# EasyEDA Pro project Raspberry_LCD_2023-10-31_10-21-50.eprj

# Schematic Schematic1
Create Date: 2023-10-31; Page Name: P1; Project Name: Raspberry_LCD_2023-10-31_10-21-50; Schematic Name: Schematic1; Update Date: 2023-10-31; Company: EasyEDA.com; Drawed: EasyEDA Pro; Page Size: A4; Part Number: JLCPCB-002; Reviewed: EasyEDA Pro; Version: V0.1
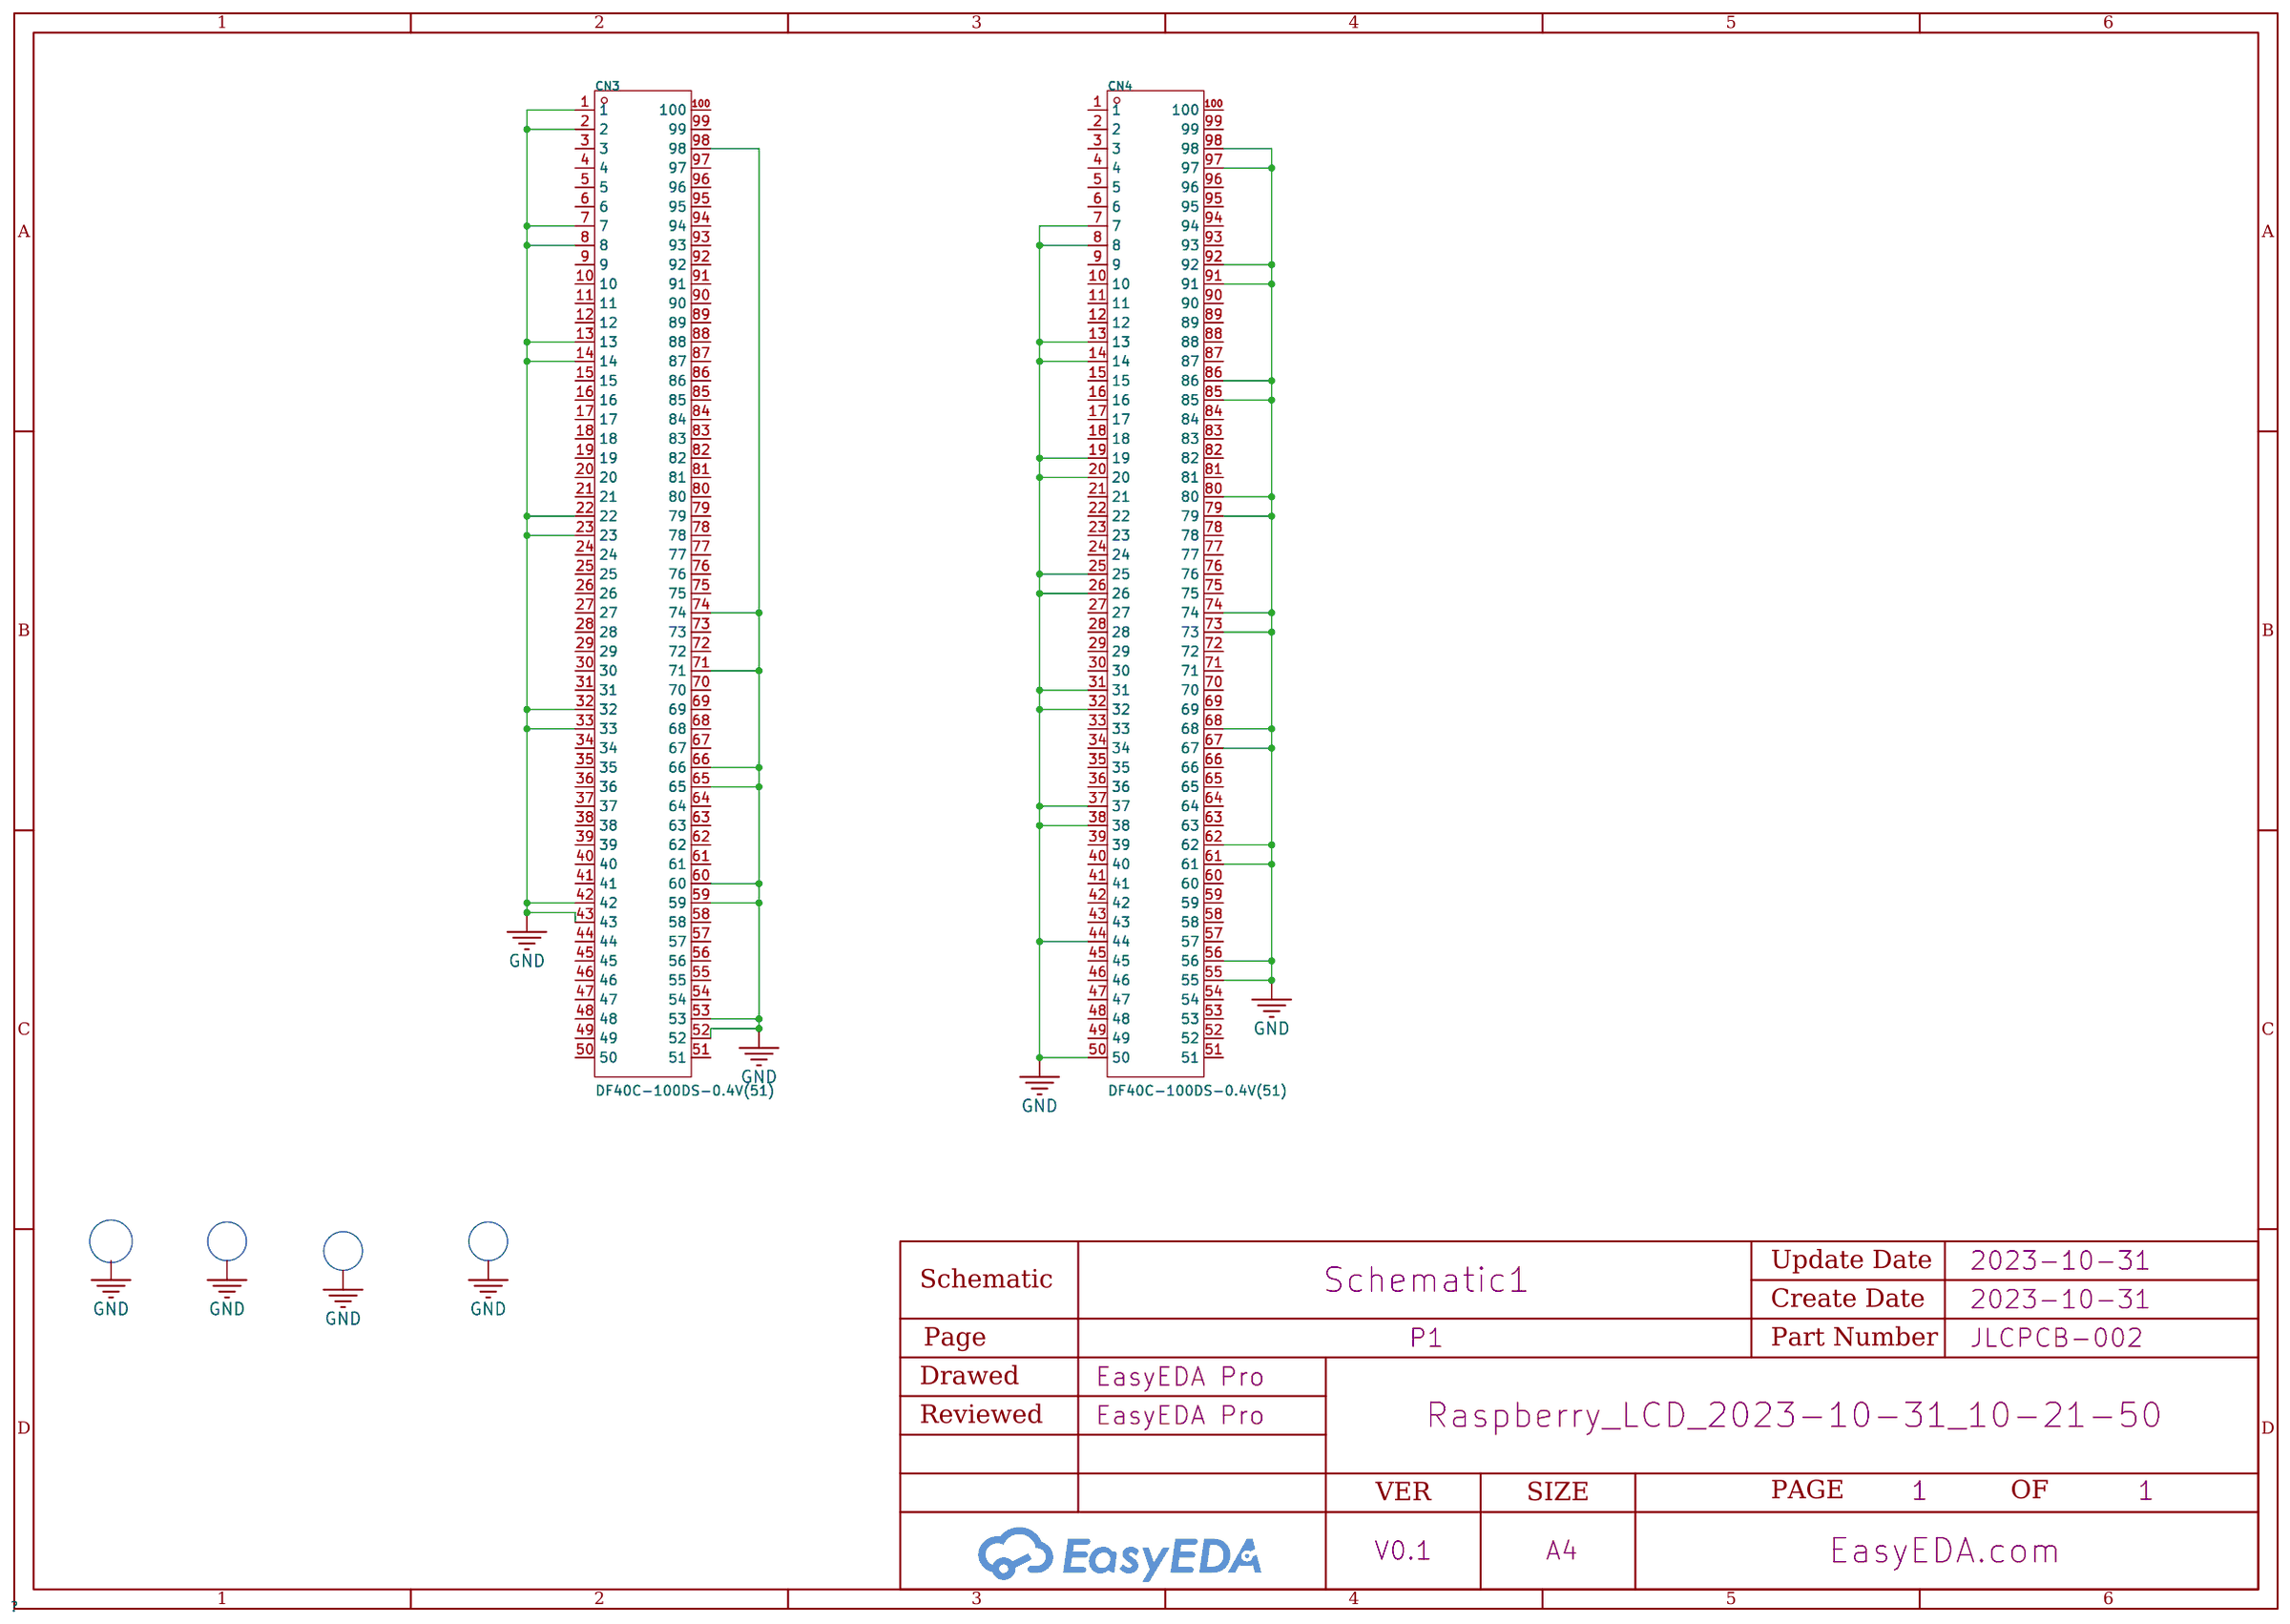
[diagram p0: schematic sheet]

## Parts
CN3  DF40C-100DS-0.4V(51)  [CONN-SMD_DF40C-100DS-0.4V-51]
CN4  DF40C-100DS-0.4V(51)  [CONN-SMD_DF40C-100DS-0.4V-51]

## Library data of the parts
CN3 CN4 = DF40C-100DS-0.4V(51): Pitch:0.4mm Number of Pins:100P Number of Rows:2 Gender:Female Mounting Style:Brick nogging Current Rating (Max):300mA Contact Plating:Gold Operating Temperature Range:-35℃~+85℃ Operating Temperature Range:-35℃~+85℃; LCSC Part Name: 间距:0.4mm PIN:100P 母 立贴; Supplier Part: C597931; Manufacturer: HRS(广濑); Supplier Footprint: SMD,P=0.4mm; JLCPCB Part Class: Extended Part; Datasheet: https://atta.szlcsc.com/upload/public/pdf/source/20200611/C597932_F50447A8BD413549CB06DCD4A9C7496A.pdf; Supplier: LCSC; Pitch: 0.4mm; Number of Pins: 100P; Number of Rows: 2; Gender: Female; Mounting Style: Brick nogging; Current Rating (Max): 300mA; Contact Plating: Gold; Operating Temperature Range: -35℃~+85℃

## Nets
GND: CN3.1 CN3.2 CN3.7 CN3.8 CN3.13 CN3.14 CN3.22 CN3.23 CN3.32 CN3.33 CN3.42 CN3.43 CN3.52 CN3.53 CN3.59 CN3.60 CN3.65 CN3.66 CN3.71 CN3.74 CN3.98 CN4.7 CN4.8 CN4.13 CN4.14 CN4.19 CN4.20 CN4.25 CN4.26 CN4.31 CN4.32 CN4.37 CN4.38 CN4.44 CN4.50 CN4.55 CN4.56 CN4.61 CN4.62 CN4.67 CN4.68 CN4.73 CN4.74 CN4.79 CN4.80 CN4.85 CN4.86 CN4.91 CN4.92 CN4.97 CN4.98

Not connected (* = marked no-connect by the designer): CN3 3 4 5 6 9 10 11 12 15 16 17 18 19 20 21 24 25 26 27 28 29 30 31 34 35 36 37 38 39 40 41 44 45 46 47 48 49 50 51 54 55 56 57 58 61 62 63 64 67 68 69 70 72 73 75 76 77 78 79 80 81 82 83 84 85 86 87 88 89 90 91 92 93 94 95 96 97 99 100; CN4 1 2 3 4 5 6 9 10 11 12 15 16 17 18 21 22 23 24 27 28 29 30 33 34 35 36 39 40 41 42 43 45 46 47 48 49 51 52 53 54 57 58 59 60 63 64 65 66 69 70 71 72 75 76 77 78 81 82 83 84 87 88 89 90 93 94 95 96 99 100

# Board PCB7
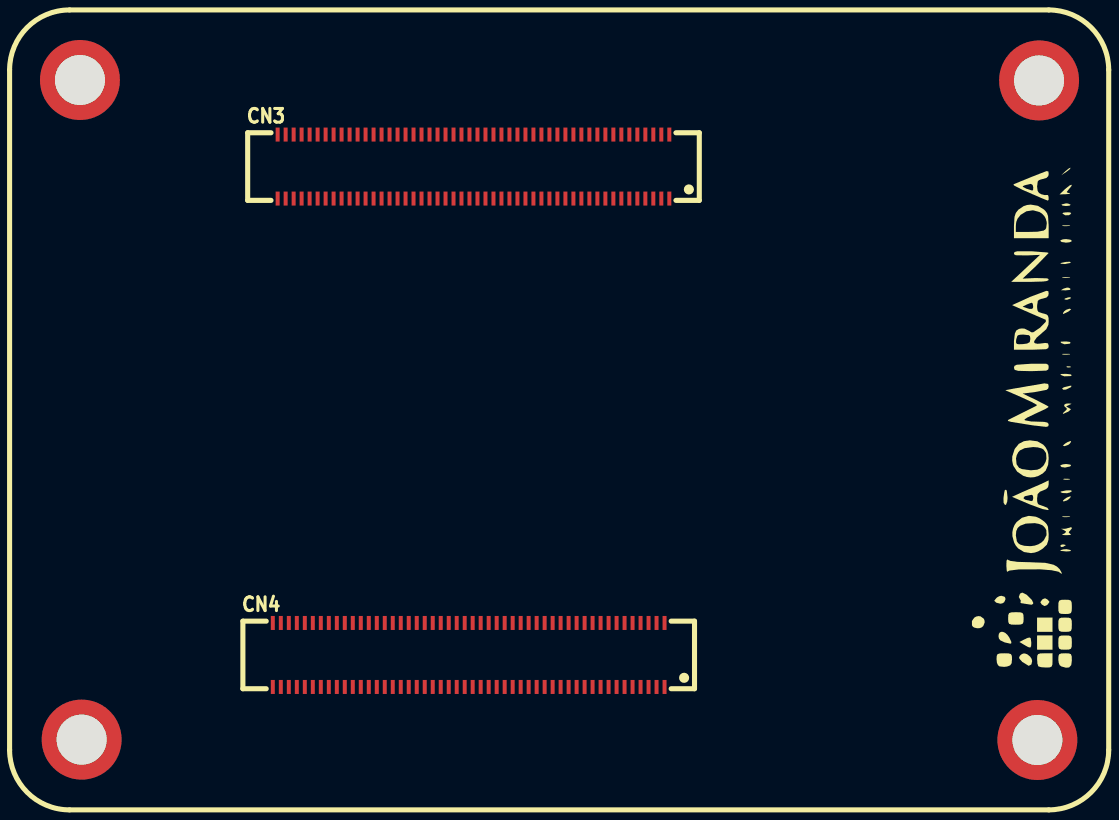
[diagram p1: board, top side]
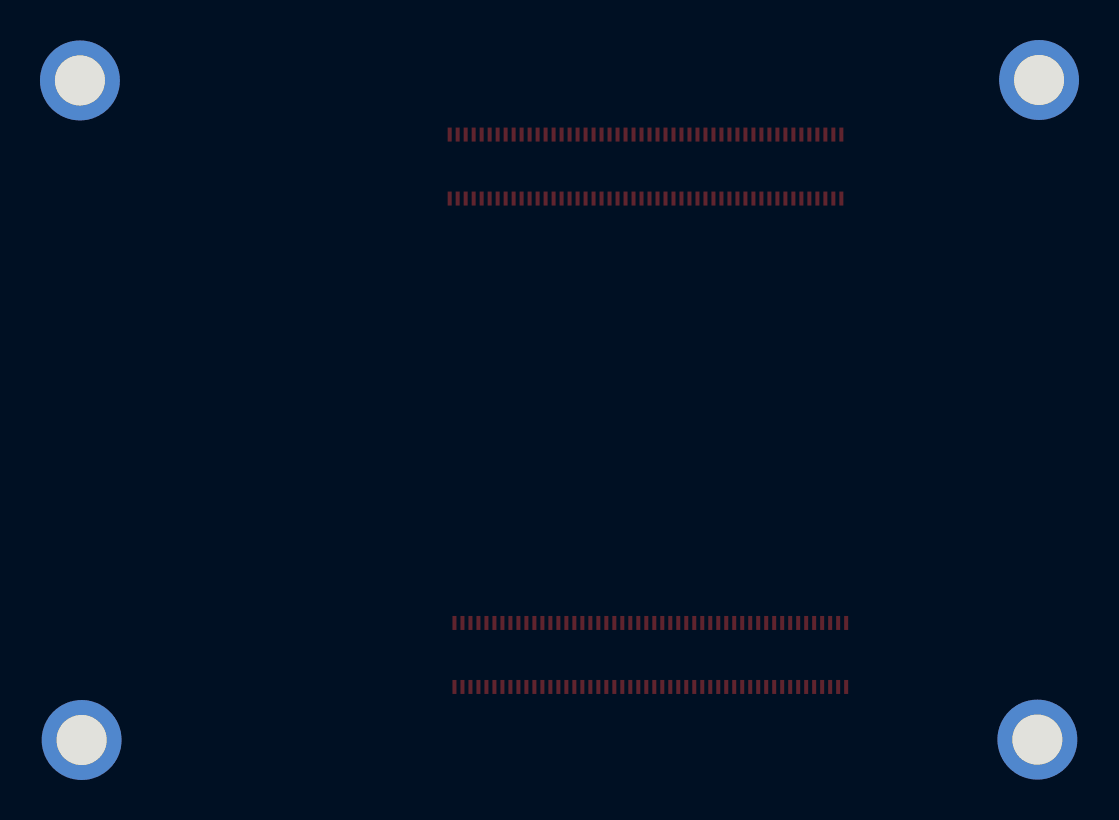
[diagram p2: board, bottom side, seen from below]

No outline. copper layers: Top Layer, Bottom Layer. Coordinates in mm from the lowest, leftmost part position.
Stack: Top Layer 0.035mm / Dielectric1 1.51mm FR4 er 4.5 / Bottom Layer 0.035mm

## Design rules (mm)
template: JLCPCB Capability(Two Layers Board)
spacing copperThickness1oz (default): track to track 0.102, other pairs 0.152 to 0.3
spacing copperThickness2oz: track to track 0.203, other pairs 0.152 to 0.3
track width copperThickness1oz (default): min 0.127, default 0.254, max 2.54
track width copperThickness2oz: min 0.203, default 0.254, max 2.54
differential pair differentialPair (default): width min 0.127, default 0.254, max 2.54; gap min 0.152, default 0.152
via viaSize (default): diameter min 0.5, default 0.61, max 10; hole min 0.3, default 0.305, max 6.3

## Placement (name value [footprint] x y rotation side)
CN3  DF40C-100DS-0.4V(51)  [CONN-SMD_DF40C-100DS-0.4V-51]  19.69 28.67 0 top
CN4  DF40C-100DS-0.4V(51)  [CONN-SMD_DF40C-100DS-0.4V-51]  19.45 4.25 0 top
NOREF  -  [Pad_e227]  48 32.98 0 top
NOREF#2  -  [Pad_e226]  47.91 0 0 top
NOREF#3  -  [Pad_e224]  0 33 0 top
NOREF#4  -  [Pad_e225]  0.09 0.02 0 top

## Footprints (pads in the part's own frame, mm; a bottom-side part is the same pattern mirrored in y, then rotated)
CONN-SMD_DF40C-100DS-0.4V-51
  rect 0.2x0.7 smd: 1(9.8,-1.6) 2(9.4,-1.6) 3(9,-1.6) 4(8.6,-1.6) 5(8.2,-1.6) 6(7.8,-1.6) 7(7.4,-1.6) 8(7,-1.6) 9(6.6,-1.6) 10(6.2,-1.6) 11(5.8,-1.6) 12(5.4,-1.6) 13(5,-1.6) 14(4.6,-1.6) 15(4.2,-1.6) 16(3.8,-1.6) 17(3.4,-1.6) 18(3,-1.6) 19(2.6,-1.6) 20(2.2,-1.6) 21(1.8,-1.6) 22(1.4,-1.6) 23(1,-1.6) 24(0.6,-1.6) 25(0.2,-1.6) 26(-0.2,-1.6) 27(-0.6,-1.6) 28(-1,-1.6) 29(-1.4,-1.6) 30(-1.8,-1.6) 31(-2.2,-1.6) 32(-2.6,-1.6) 33(-3,-1.6) 34(-3.4,-1.6) 35(-3.8,-1.6) 36(-4.2,-1.6) 37(-4.6,-1.6) 38(-5,-1.6) 39(-5.4,-1.6) 40(-5.8,-1.6) 41(-6.2,-1.6) 42(-6.6,-1.6) 43(-7,-1.6) 44(-7.4,-1.6) 45(-7.8,-1.6) 46(-8.2,-1.6) 47(-8.6,-1.6) 48(-9,-1.6) 49(-9.4,-1.6) 50(-9.8,-1.6) 51(-9.8,1.6) 52(-9.4,1.6) 53(-9,1.6) 54(-8.6,1.6) 55(-8.2,1.6) 56(-7.8,1.6) 57(-7.4,1.6) 58(-7,1.6) 59(-6.6,1.6) 60(-6.2,1.6) 61(-5.8,1.6) 62(-5.4,1.6) 63(-5,1.6) 64(-4.6,1.6) 65(-4.2,1.6) 66(-3.8,1.6) 67(-3.4,1.6) 68(-3,1.6) 69(-2.6,1.6) 70(-2.2,1.6) 71(-1.8,1.6) 72(-1.4,1.6) 73(-1,1.6) 74(-0.6,1.6) 75(-0.2,1.6) 76(0.2,1.6) 77(0.6,1.6) 78(1,1.6) 79(1.4,1.6) 80(1.8,1.6) 81(2.2,1.6) 82(2.6,1.6) 83(3,1.6) 84(3.4,1.6) 85(3.8,1.6) 86(4.2,1.6) 87(4.6,1.6) 88(5,1.6) 89(5.4,1.6) 90(5.8,1.6) 91(6.2,1.6) 92(6.6,1.6) 93(7,1.6) 94(7.4,1.6) 95(7.8,1.6) 96(8.2,1.6) 97(8.6,1.6) 98(9,1.6) 99(9.4,1.6) 100(9.8,1.6)
Pad_e224
  round 4 hole 2.5: 1(0,0)
Pad_e225
  round 4 hole 2.5: 2(0,0)
Pad_e226
  round 4 hole 2.5: 3(0,0)
Pad_e227
  round 4 hole 2.5: 4(0,0)

## Nets
As in the schematic.

Pads without a net: CN3 3 4 5 6 9 10 11 12 15 16 17 18 19 20 21 24 25 26 27 28 29 30 31 34 35 36 37 38 39 40 41 44 45 46 47 48 49 50 51 54 55 56 57 58 61 62 63 64 67 68 69 70 72 73 75 76 77 78 79 80 81 82 83 84 85 86 87 88 89 90 91 92 93 94 95 96 97 99 100; CN4 1 2 3 4 5 6 9 10 11 12 15 16 17 18 21 22 23 24 27 28 29 30 33 34 35 36 39 40 41 42 43 45 46 47 48 49 51 52 53 54 57 58 59 60 63 64 65 66 69 70 71 72 75 76 77 78 81 82 83 84 87 88 89 90 93 94 95 96 99 100; NOREF 4; NOREF#2 3; NOREF#3 1; NOREF#4 2
